# Altium schematic sheet 10 isolator.SchDoc
size A4; DocumentNumber: 10; SheetNumber: 12; SheetTotal: 12
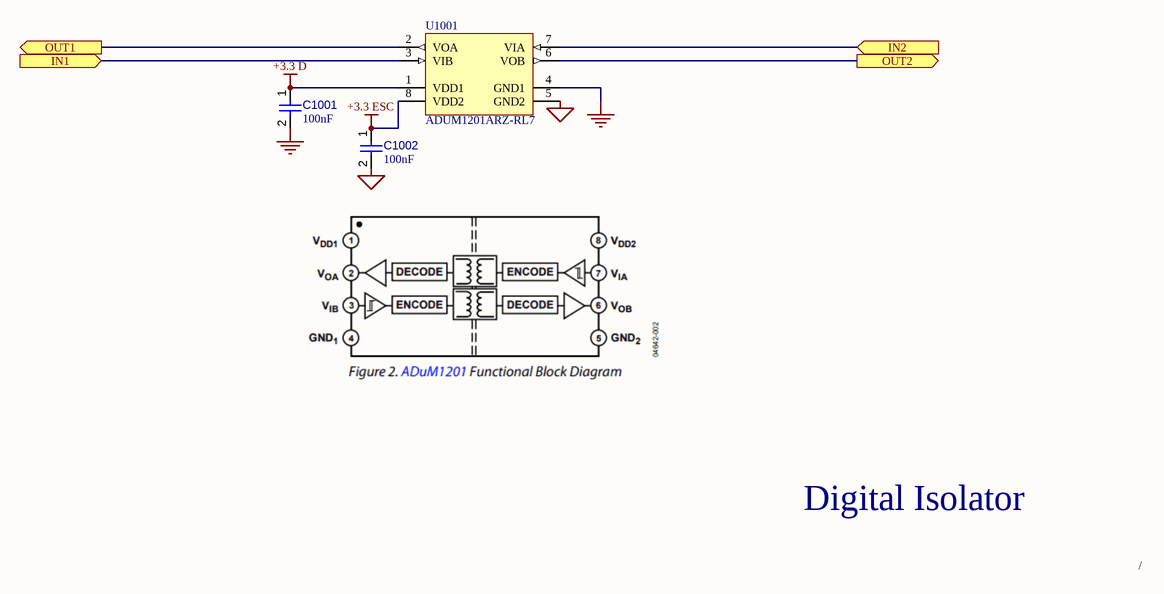
[diagram p0: 10 isolator.SchDoc]

## Parts
C1001  value 100nF  [CAPC0402(1005)60_L]  (hidden comment: Capacitor 100nF +/-20% 25V 0402)
C1002  value 100nF  [CAPC0402(1005)60_L]  (hidden comment: Capacitor 100nF +/-20% 25V 0402)
U1001  ADUM1201ARZ-RL7  [ADI-R-8_L]

## Ports
IN1 (in), IN2 (in), OUT1 (out), OUT2 (out)

## Nets
+3.3 D: C1001.1 U1001.1(VDD1)
+3.3 ESC: C1002.1 U1001.8(VDD2)
GND: C1001.2 U1001.4(GND1)
PGND: C1002.2 U1001.5(GND2)
IN1: U1001.3(VIB) ; port IN1
IN2: U1001.7(VIA) ; port IN2
OUT1: U1001.2(VOA) ; port OUT1
OUT2: U1001.6(VOB) ; port OUT2

## Notes on the sheet
- Digital Isolator
- /

## Library data of the parts
C1001 C1002 = CMP-001-00065-4: Chip Capacitor, 100nF +/-20%, 25V, 0402, Thickness 0.6 mm; Tolerance: 10%; Max Operating Temperature: 85°C; Min Operating Temperature: -55°C; Pins: 2; Voltage Rating: 25V; Mounting Technology: SMT; Case/Package: 0402
U1001 = CMP-0534-00063-1: Dual Channel Digital Isolator, 2.5 KV rms Insulation Rating, 1 Mbps Data Rate, 150 ns Delay, Industrial, 8-pin SOIC (R-8), Reel; Manufacturer: Analog Devices; Insulation Rating (kVrms): 2.5; Max Data Rate: 1Mbps; ComponentLink3Description: Package Specification; ComponentLink1Description: Manufacturer URL; ComponentLink4Description: URL Link1; PackageReference: R-8; PackageVersion: 060506-A, 06/2006; ComponentLink3URL: http://www.analog.com/static/imported-files/packages/PKG_PDF/SOIC_Narrow%20(R)/R_8.pdf; ComponentLink5Description: URL Link2; ComponentLink2Description: Datasheet; Mounting Technology: Surface Mount; ComponentLink5URL: Reference Circuit:http://www.analog.com/en/interface-isolation/digital-isolators/adum1201/products/product.html#product-recommendations; Code_JEDEC: MS-012-AA; DatasheetVersion: Rev. I; PartNumber: ADUM1201ARZ-RL7; ComponentLink1URL: http://www.analog.com/en/index.html; ComponentLink2URL: http://www.analog.com/static/imported-files/data_sheets/ADuM1200_1201.pdf; Max Operating Temp (degreesC): 125; PackageDescription: 8-Pin Standard Small Outline Package, Body 4.9 x 3.9 mm, Pitch 1.27 mm; ComponentLink4URL: Product URL:http://www.analog.com/en/interface-isolation/digital-isolators/adum1201/products/product.html